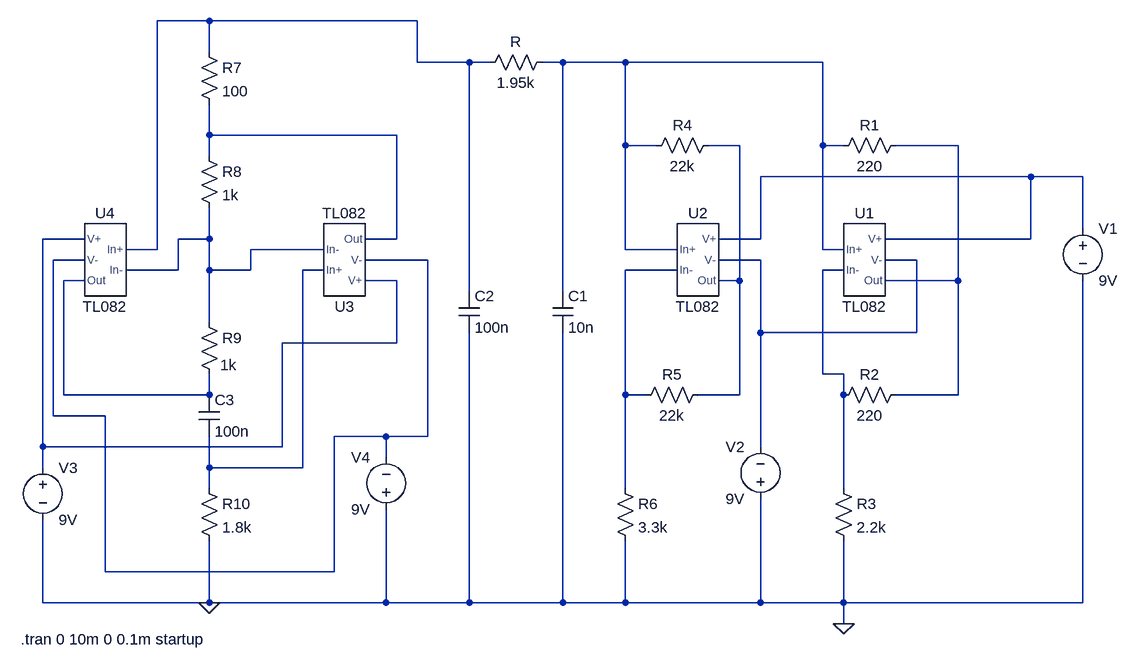
[diagram p0: schematic chua_TL082 (copy).asc]
chua_TL082 (copy).asc, the LTspice schematic file:
Version 4
SHEET 1 960 760
WIRE -528 -208 -608 -208
WIRE -208 -208 -528 -208
WIRE -528 -160 -528 -208
WIRE -208 -144 -208 -208
WIRE -128 -144 -208 -144
WIRE -96 -144 -128 -144
WIRE 16 -144 -16 -144
WIRE 112 -144 16 -144
WIRE 416 -144 112 -144
WIRE -528 -32 -528 -80
WIRE -240 -32 -528 -32
WIRE 112 -16 112 -144
WIRE 160 -16 112 -16
WIRE 288 -16 240 -16
WIRE 416 -16 416 -144
WIRE 448 -16 416 -16
WIRE 624 -16 528 -16
WIRE -528 0 -528 -32
WIRE 736 32 320 32
WIRE 816 32 736 32
WIRE 816 112 816 32
WIRE -720 128 -784 128
WIRE -528 128 -528 80
WIRE -528 128 -576 128
WIRE -240 128 -240 -32
WIRE -240 128 -288 128
WIRE 320 128 320 32
WIRE 320 128 256 128
WIRE 736 128 736 32
WIRE 736 128 512 128
WIRE -608 144 -608 -208
WIRE -608 144 -656 144
WIRE -352 144 -464 144
WIRE 112 144 112 -16
WIRE 192 144 112 144
WIRE 416 144 416 -16
WIRE 448 144 416 144
WIRE -720 160 -768 160
WIRE -192 160 -288 160
WIRE 320 160 256 160
WIRE 560 160 512 160
WIRE -576 176 -576 128
WIRE -576 176 -656 176
WIRE -528 176 -528 128
WIRE -464 176 -464 144
WIRE -464 176 -528 176
WIRE -352 176 -384 176
WIRE 192 176 112 176
WIRE 448 176 416 176
WIRE -720 192 -752 192
WIRE -240 192 -288 192
WIRE 288 192 288 -16
WIRE 288 192 256 192
WIRE 624 192 624 -16
WIRE 624 192 512 192
WIRE -128 208 -128 -144
WIRE 16 208 16 -144
WIRE -528 256 -528 176
WIRE 320 272 320 160
WIRE 560 272 560 160
WIRE 560 272 320 272
WIRE -240 288 -240 192
WIRE -240 288 -416 288
WIRE 416 336 416 176
WIRE 448 336 416 336
WIRE -752 368 -752 192
WIRE -528 368 -528 336
WIRE -528 368 -752 368
WIRE 112 368 112 176
WIRE 144 368 112 368
WIRE 288 368 288 192
WIRE 288 368 224 368
WIRE 448 368 448 336
WIRE 624 368 624 192
WIRE 624 368 528 368
WIRE -768 400 -768 160
WIRE -688 400 -768 400
WIRE -256 432 -336 432
WIRE -192 432 -192 160
WIRE -192 432 -256 432
WIRE -784 448 -784 128
WIRE -416 448 -416 288
WIRE -416 448 -784 448
WIRE 320 448 320 272
WIRE -256 464 -256 432
WIRE -784 480 -784 448
WIRE -528 480 -528 432
WIRE -384 480 -384 176
WIRE -384 480 -528 480
WIRE -528 512 -528 480
WIRE 112 512 112 368
WIRE 448 512 448 368
WIRE -688 640 -688 400
WIRE -336 640 -336 432
WIRE -336 640 -688 640
WIRE -784 688 -784 560
WIRE -528 688 -528 592
WIRE -528 688 -784 688
WIRE -256 688 -256 544
WIRE -256 688 -528 688
WIRE -128 688 -128 272
WIRE -128 688 -256 688
WIRE 16 688 16 272
WIRE 16 688 -128 688
WIRE 112 688 112 592
WIRE 112 688 16 688
WIRE 320 688 320 528
WIRE 320 688 112 688
WIRE 448 688 448 592
WIRE 448 688 320 688
WIRE 816 688 816 192
WIRE 816 688 448 688
WIRE 448 720 448 688
FLAG 448 720 0
FLAG -528 688 0
SYMBOL TL082 480 160 R0
SYMATTR InstName U1
SYMBOL TL082 224 160 R0
SYMATTR InstName U2
SYMBOL res 544 -32 R90
WINDOW 0 0 56 VBottom 2
WINDOW 3 32 56 VTop 2
SYMATTR InstName R1
SYMATTR Value 220
SYMATTR SpiceLine tol=5
SYMBOL res 544 352 R90
WINDOW 0 0 56 VBottom 2
WINDOW 3 32 56 VTop 2
SYMATTR InstName R2
SYMATTR Value 220
SYMATTR SpiceLine tol=5
SYMBOL res 432 496 R0
SYMATTR InstName R3
SYMATTR Value 2.2k
SYMATTR SpiceLine tol=5
SYMBOL voltage 320 544 R180
WINDOW 0 24 96 Left 2
WINDOW 3 24 16 Left 2
WINDOW 123 0 0 Left 0
WINDOW 39 0 0 Left 0
SYMATTR InstName V2
SYMATTR Value 9V
SYMBOL voltage 816 96 R0
WINDOW 123 0 0 Left 0
WINDOW 39 0 0 Left 0
SYMATTR InstName V1
SYMATTR Value 9V
SYMBOL res 256 -32 R90
WINDOW 0 0 56 VBottom 2
WINDOW 3 32 56 VTop 2
SYMATTR InstName R4
SYMATTR Value 22k
SYMATTR SpiceLine tol=5
SYMBOL res 240 352 R90
WINDOW 0 0 56 VBottom 2
WINDOW 3 32 56 VTop 2
SYMATTR InstName R5
SYMATTR Value 22k
SYMATTR SpiceLine tol=2
SYMBOL res 96 496 R0
SYMATTR InstName R6
SYMATTR Value 3.3k
SYMATTR SpiceLine tol=5
SYMBOL res 0 -160 R90
WINDOW 0 0 56 VBottom 2
WINDOW 3 32 56 VTop 2
SYMATTR InstName R
SYMATTR Value 1.95k
SYMATTR SpiceLine tol=5
SYMBOL cap 0 208 R0
SYMATTR InstName C1
SYMATTR Value 10n
SYMBOL cap -144 208 R0
SYMATTR InstName C2
SYMATTR Value 100n
SYMBOL TL082 -320 160 M180
SYMATTR InstName U3
SYMBOL TL082 -688 160 M0
SYMATTR InstName U4
SYMBOL res -544 -176 R0
SYMATTR InstName R7
SYMATTR Value 100
SYMBOL res -544 -16 R0
SYMATTR InstName R8
SYMATTR Value 1k
SYMBOL res -544 240 R0
WINDOW 3 33 82 Left 2
SYMATTR Value 1k
SYMATTR InstName R9
SYMBOL res -544 496 R0
SYMATTR InstName R10
SYMATTR Value 1.8k
SYMBOL cap -544 368 R0
SYMATTR InstName C3
SYMATTR Value 100n
SYMBOL voltage -784 464 R0
WINDOW 123 0 0 Left 0
WINDOW 39 0 0 Left 0
SYMATTR InstName V3
SYMATTR Value 9V
SYMBOL voltage -256 560 R180
WINDOW 0 24 96 Left 2
WINDOW 3 24 16 Left 2
WINDOW 123 0 0 Left 0
WINDOW 39 0 0 Left 0
SYMATTR InstName V4
SYMATTR Value 9V
TEXT -818 744 Left 2 !.tran 0 10m 0 0.1m startup

The netlist it stands for:
* chua_TL082 (copy).asc
XU1 N002 N013 N006 N010 N005 TL082  ; pins In+ In- V+ V- Out
XU2 N002 N012 N006 N010 N004 TL082  ; pins In+ In- V+ V- Out
R1 N005 N002 220 tol=5
R2 N005 N013 220 tol=5
R3 N013 0 2.2k tol=5
V2 0 N010 9V
V1 N006 0 9V
R4 N004 N002 22k tol=5
R5 N004 N012 22k tol=2
R6 N012 0 3.3k tol=5
R N002 N001 1.95k tol=5
C1 N002 0 10n
C2 N001 0 100n
XU3 N011 N008 N007 N009 N003 TL082  ; pins In+ In- V+ V- Out
XU4 N001 N008 N007 N009 N014 TL082  ; pins In+ In- V+ V- Out
R7 N001 N003 100
R8 N003 N008 1k
R9 N008 N014 1k
R10 N011 0 1.8k
C3 N014 N011 100n
V3 N007 0 9V
V4 0 N009 9V
.tran 0 10m 0 0.1m startup
.lib TL082.sub
.backanno
.end